# EAGLE design arduino-shield (EAGLE 7.7.0)

## Sheet 1 of 2
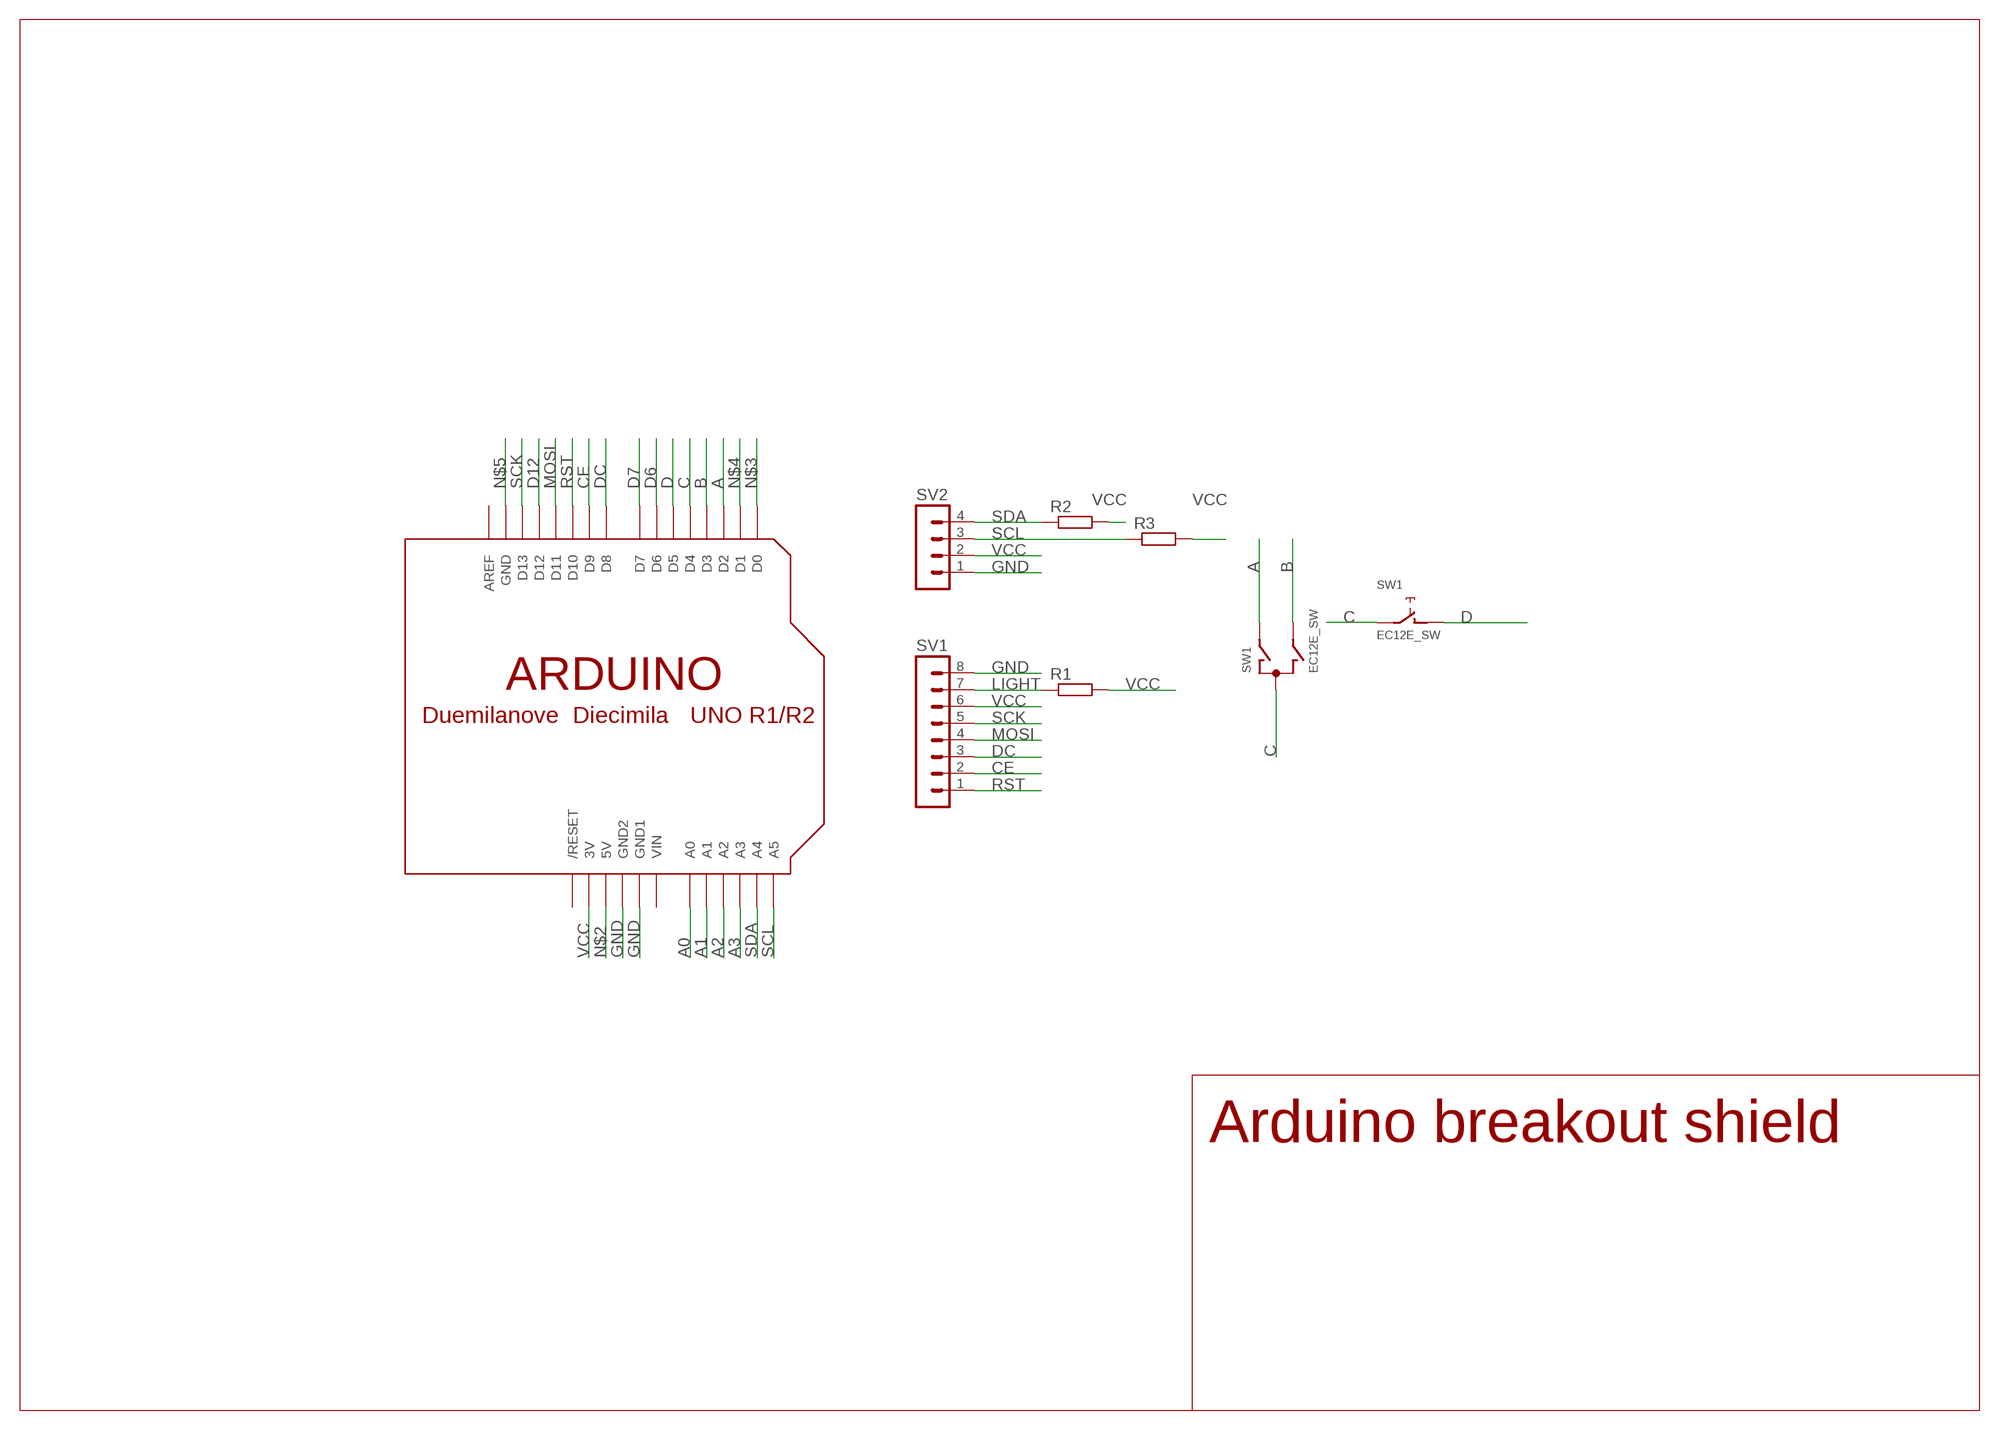
[diagram p0: schematic, sheet 1]

### Parts
R1  R-EU_R0805  [R0805]
R2  R-EU_R0805  [R0805]
R3  R-EU_R0805  [R0805]
SV1  MA08-1  [MA08-1]
SV2  MA04-1  [MA04-1]
SW1  EC12E_SW  [ALPS_EC12E_SW]
U$1  ARDUINO-NOHOLE  [ARDUINO-NOHOLE]

### Nets
A: SW1.A U$1.D2
A0: U$1.A0
A1: U$1.A1
A2: U$1.A2
A3: U$1.A3
B: SW1.B U$1.D3
C: SW1.C SW1.E U$1.D4
CE: SV1.2 U$1.D9
D: SW1.D U$1.D5
D6: U$1.D6
D7: U$1.D7
D12: U$1.D12
DC: SV1.3 U$1.D8
GND: SV1.8 SV2.1 U$1.GND1 U$1.GND2
LIGHT: R1.1 SV1.7
MOSI: SV1.4 U$1.D11
N$2: U$1.5V
N$3: U$1.D0
N$4: U$1.D1
N$5: U$1.GND
RST: SV1.1 U$1.D10
SCK: SV1.5 U$1.D13
SCL: R3.1 SV2.3 U$1.A5
SDA: R2.1 SV2.4 U$1.A4
VCC: R1.2 R2.2 R3.2 SV1.6 SV2.2 U$1.3V
Unconnected: SW1.GND1(G) SW1.GND2(G) U$1.AREF U$1.RESET(/RESET)

### Notes on the sheet
- Arduino breakout shield

## Sheet 2 of 2
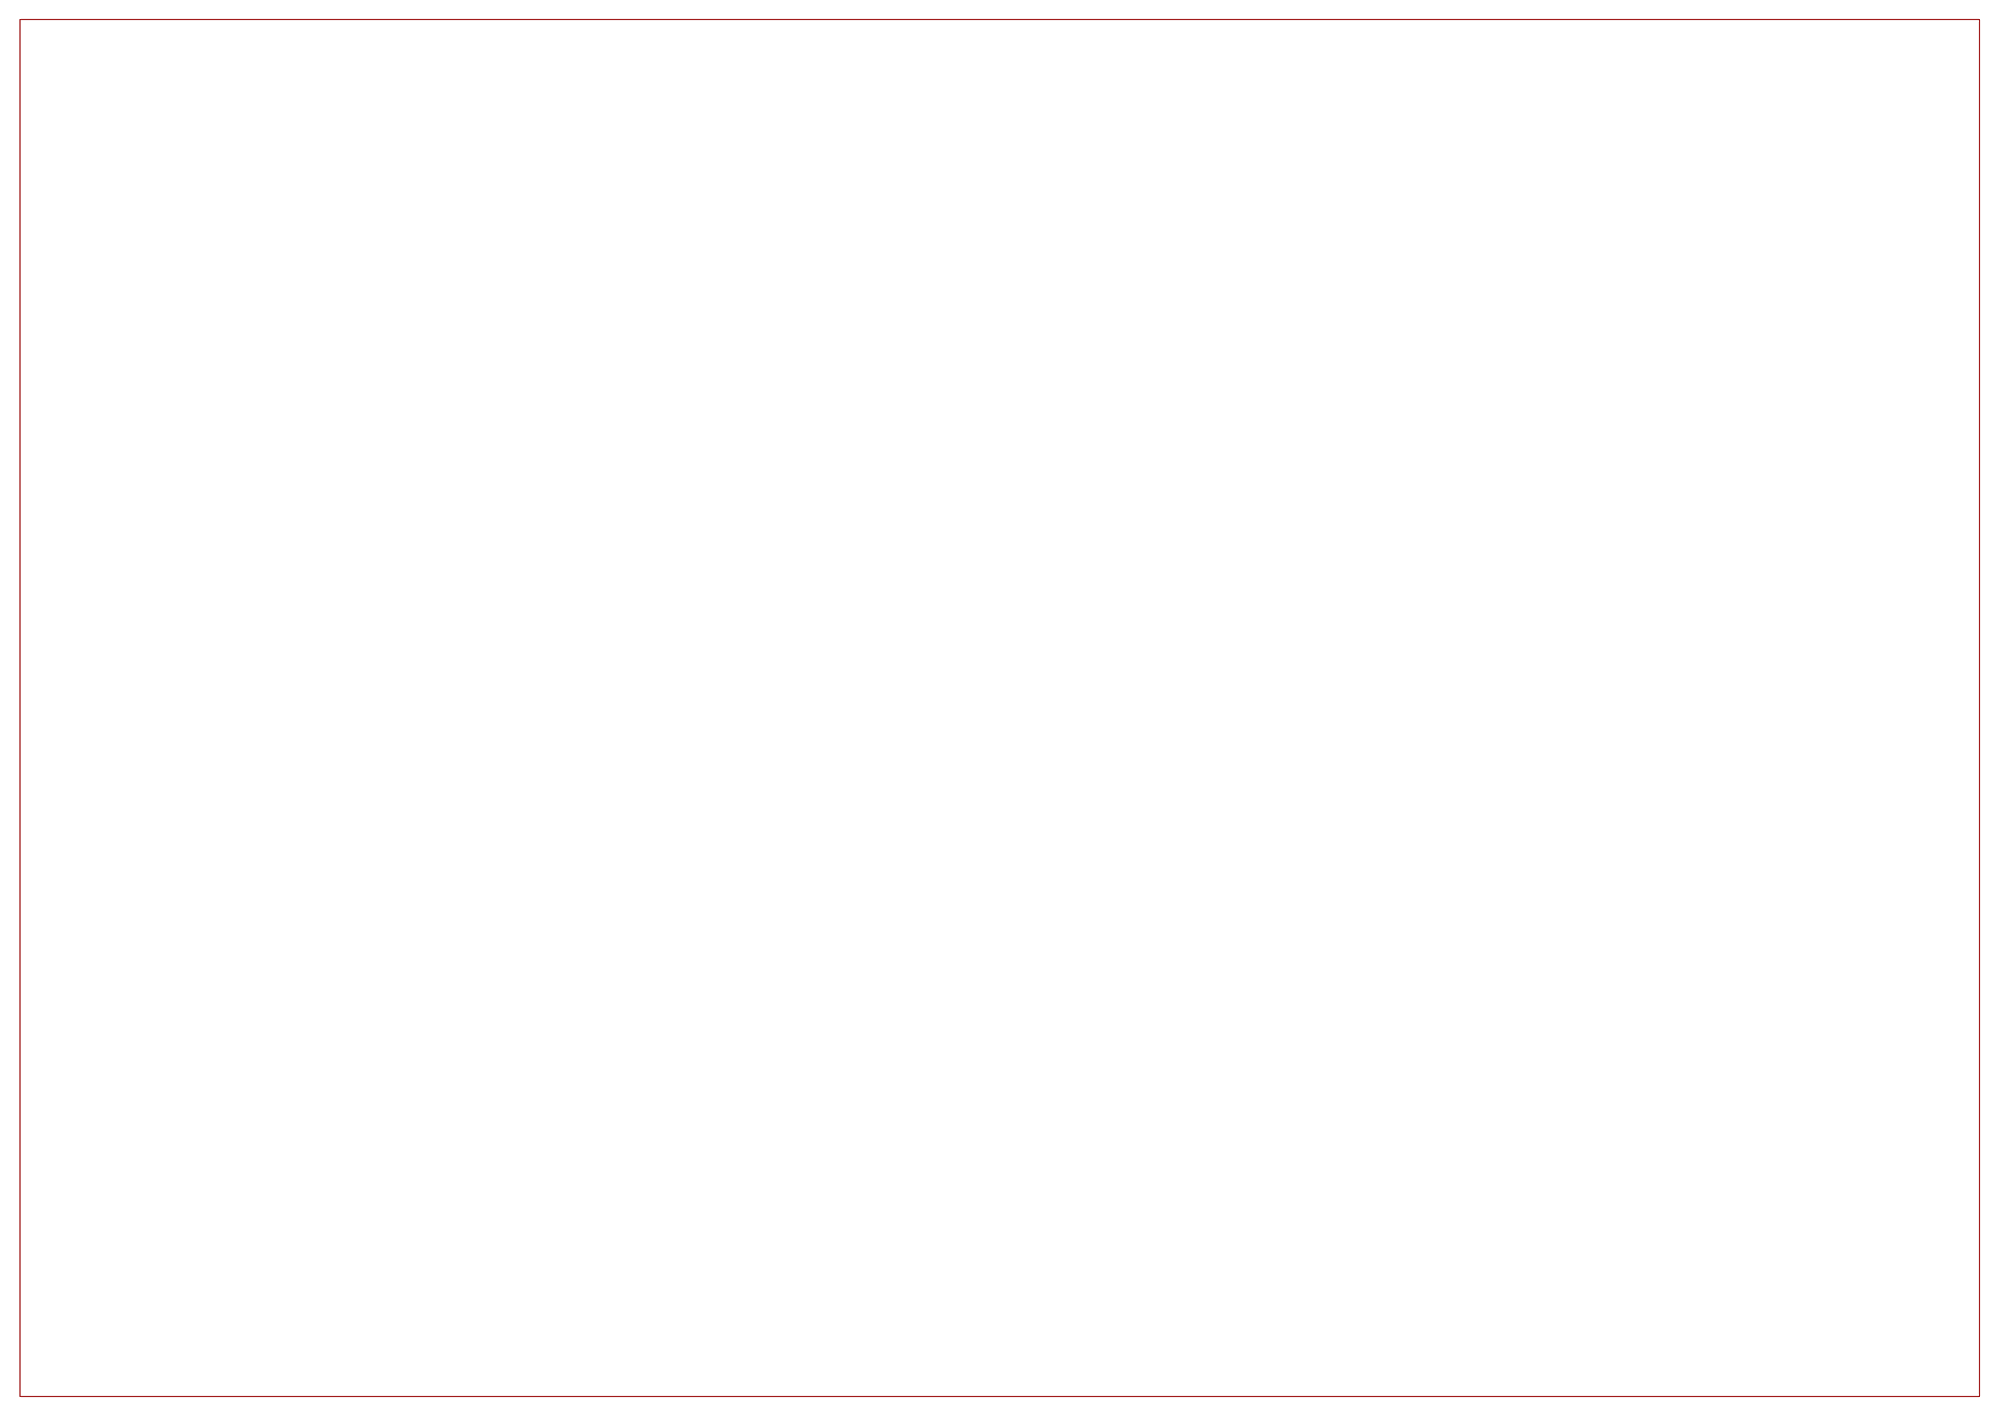
[diagram p1: schematic, sheet 2]

## Power pins joined to a net without a drawn wire
VIN: U$1.VIN

## Library data of the parts
R1-R3 = rcl:R-EU_: RESISTOR, European symbol
SV1 = con-lstb:MA08-1: PIN HEADER; OC_FARNELL: unknown; OC_NEWARK: unknown
SV2 = con-lstb:MA04-1: PIN HEADER; OC_FARNELL: unknown; OC_NEWARK: unknown
SW1 = switch-alps:EC12E_SW: ALPS rotary Encoder EC12E series with switch; MPN: EC12E2424407; OC_FARNELL: 1520813; OC_NEWARK: 74M1068
U$1 = adafruit:ARDUINO: Arduino Diecimila/Duemilanove Make a shield with ease, this package has all the named pins as well as the two mounting drill holes and an outline of the USB and DC power connector. The outline is on the DIMENSION layer, so if your board house uses it they will cut the outline to match. http://www.ladyada.net/library/pcb/eaglelibrary.html

## Board
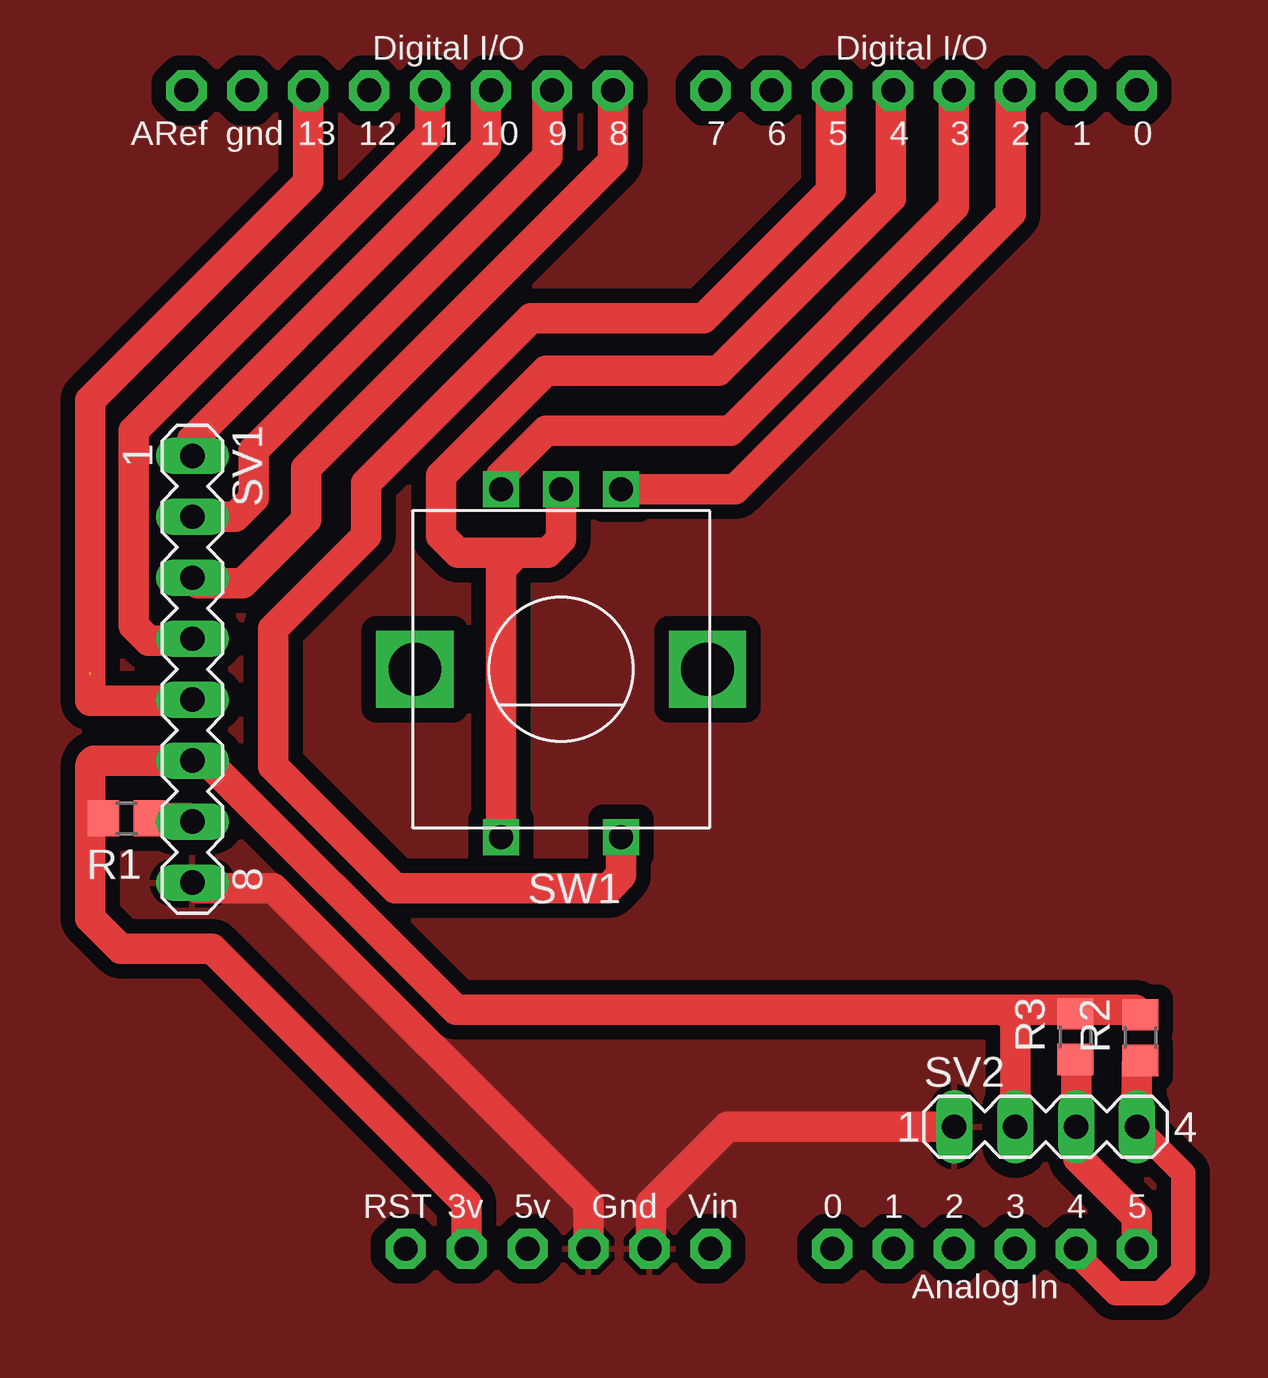
[diagram p2: board, top side]
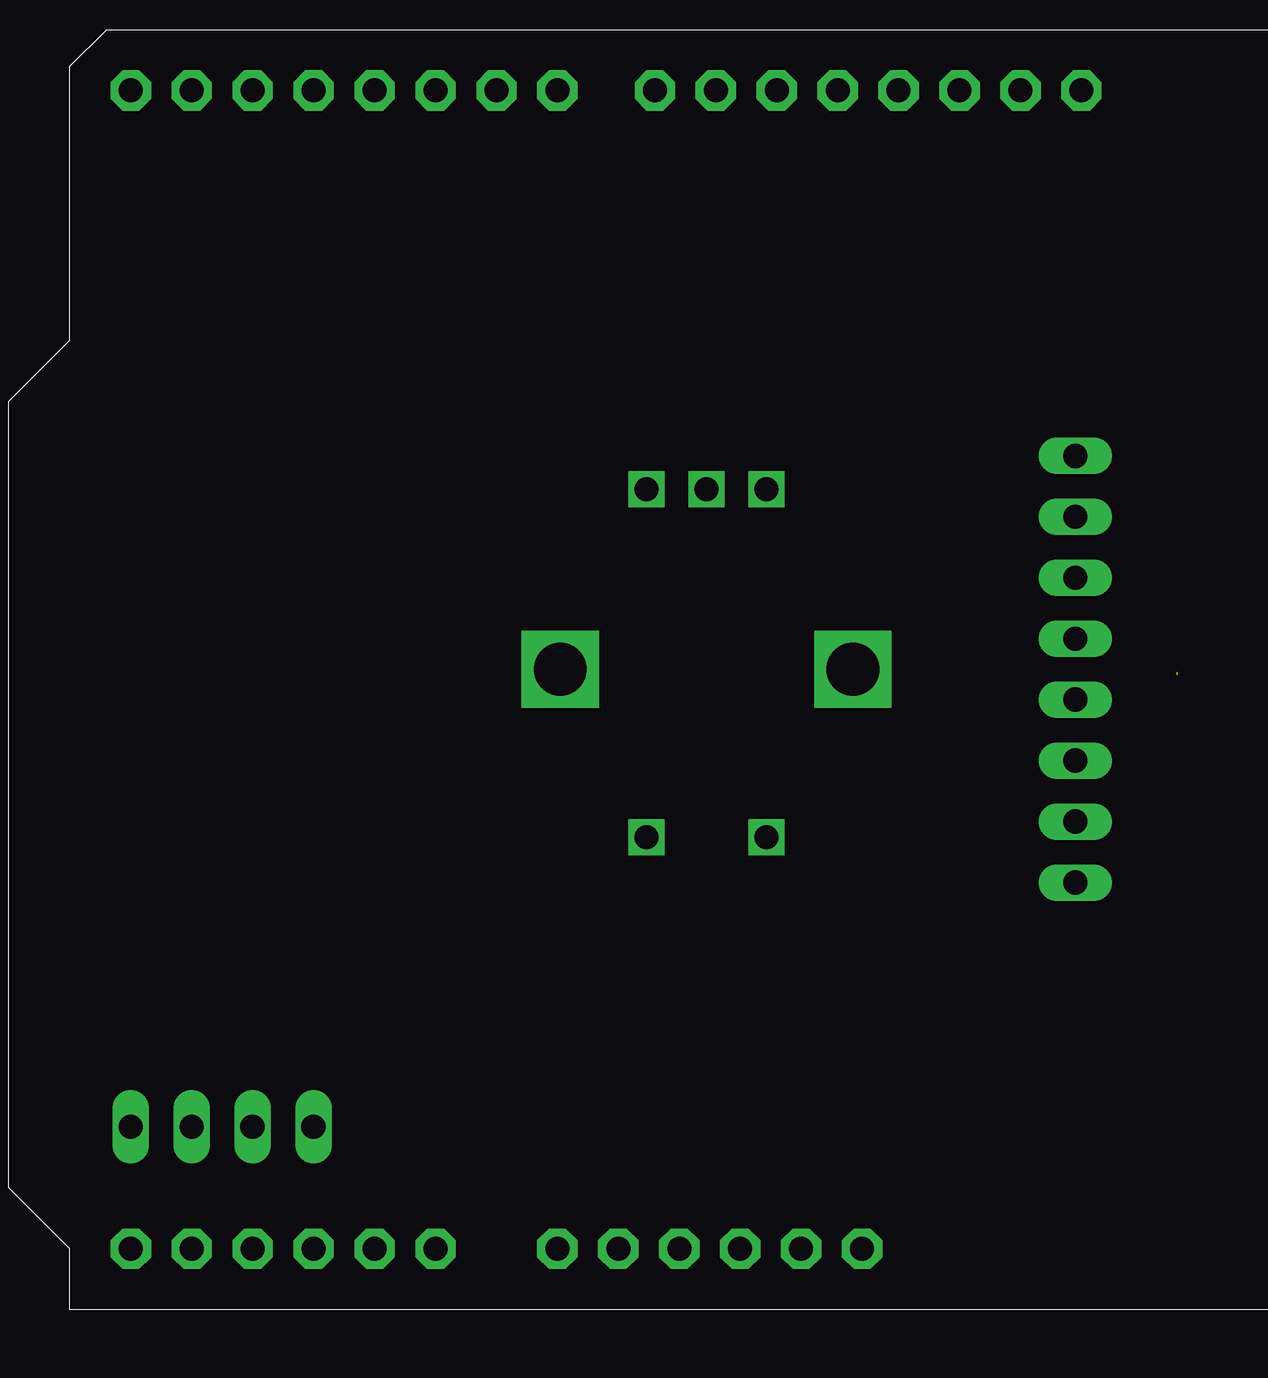
[diagram p3: board, bottom side, seen from below]

No outline drawn. Coordinates in mm, seen from the top.
Copper layers (1*16): Top 0.035mm / dielectric 1.5mm / Bottom 0.035mm
Design rules "default": minimum track width 10mil, minimum drill 24mil, track to track 8mil, track to pad 8mil, pad to pad 8mil, via to via 8mil, smd to smd 8mil, copper to edge 40mil, drill to drill 8mil, minimum pad ring 10mil, minimum via ring 8mil, stop-mask expansion 4mil, vias tented up to drill 0mil, thermal gap 10mil

### Footprints (pad centres in the part's own frame; a part is rotated, then mirrored left to right if it is on the bottom)
R0805 = smd 1.3 x 1.5: 1 -0.95,0; 2 0.95,0
MA08-1 = drill 1.016 long: 1 -8.89,0; 2 -6.35,0; 3 -3.81,0; 4 -1.27,0; 5 1.27,0; 6 3.81,0; 7 6.35,0; 8 8.89,0
MA04-1 = drill 1.016 long: 1 -3.81,0; 2 -1.27,0; 3 1.27,0; 4 3.81,0
ALPS_EC12E_SW = drill 1 square: A -2.5,-7.5; B 2.5,-7.5; C 0,-7.5; D -2.5,7; E 2.5,7 | drill 2.2 square: GND1 -6.1,0; GND2 6.1,0
ARDUINO-NOHOLE = drill 1 pad 1.676 octagon: 3V 35.56,2.54; 5V 38.1,2.54; A0 50.8,2.54; A1 53.34,2.54; A2 55.88,2.54; A3 58.42,2.54; A4 60.96,2.54; A5 63.5,2.54; AREF 23.876,50.8; D0 63.5,50.8; D1 60.96,50.8; D2 58.42,50.8; D3 55.88,50.8; D4 53.34,50.8; D5 50.8,50.8; D6 48.26,50.8; D7 45.72,50.8; D8 41.656,50.8; D9 39.116,50.8; D10 36.576,50.8; D11 34.036,50.8; D12 31.496,50.8; D13 28.956,50.8; GND 26.416,50.8; GND1 43.18,2.54; GND2 40.64,2.54; RESET 33.02,2.54; VIN 45.72,2.54

### Placement (x,y rotation side)
R1  25.62,23.23 180 top
R2  67.9,14.09 90 top
R3  65.19,14.12 90 top
SV1  28.38,29.44 270 top
SV2  63.95,10.37 0 top
SW1  43.75,29.44 180 top
U$1  4.25,2.75 0 top

### Tracks (layer width: path | path; a pad name or v marks a point on that pad's centre or on a via)
A
  Top 1.27: SW1.A 51,36.94 62.5,48.44 62.5,53.38 U$1.D2
B
  Top 1.27: SW1.B 41.25,37.5 43.12,39.37 50.8,39.37 60.13,48.7 U$1.D3
C
  Top 1.27: SW1.C 43.75,34.86 43.18,34.29 41.91,34.29 | 41.91,34.29 39.46,34.29 38.75,35 38.75,37.5 43.12,41.88 50.31,41.88 57.5,49.06 57.5,53.46 U$1.D4 | SW1.E 41.25,33.63 41.91,34.29
CE
  Top 1.27: SV1.2 30.16,35.79 30.94,36.56 30.94,38.56 43.18,50.8 43.18,53.36 U$1.D9
D
  Top 1.27: SW1.D 46.25,20.85 45.72,20.32 36.83,20.32 31.75,25.4 31.75,31.12 35.62,35 35.62,37.19 42.5,44.06 49.69,44.06 55,49.38 55,53.5 U$1.D5
DC
  Top 1.27: U$1.D8 45.91,50.59 33.12,37.81 33.12,35.66 30.48,33.02 28.61,33.02 SV1.3
GND
  Top 1.27: U$1.GND2 44.89,7.18 31.75,20.32 28.61,20.32 SV1.8 | SV2.1 50.69,10.37 47.5,7.19 47.5,5.36 U$1.GND1
  pour Top (isolate 0.61): 0,-3.81 76.2,-3.81 76.2,58.42 0,58.42
LIGHT
  Top 1.27: R1.1 28.24,23.23 SV1.7
MOSI
  Top 1.27: U$1.D11 38.29,51.72 25.94,39.38 25.94,31.25 26.56,30.62 28.3,30.62 SV1.4
RST
  Top 1.27: SV1.1 28.38,39.01 40.62,51.25 40.62,53.35 U$1.D10
SCK  (1 unrouted)
  Top 1.27: U$1.D13 33.21,49.72 24.13,40.64 24.13,29.31 | SV1.5 28.34,28.12 24.13,28.12 24.13,29.21
SCL
  Top 1.27: U$1.A5 67.75,6.62 65.31,9.06 65.31,10.28 SV2.3 65.22,13.14 R3.1
SDA
  Top 1.016: U$1.A4 65.21,5.1 66.88,3.44 68.75,3.44 69.69,4.38 69.69,8.44 SV2.4
  Top 1.27: R2.1 67.75,12.99 SV2.4
VCC
  Top 1.27: U$1.3V 39.81,7.18 29.21,17.78 25.4,17.78 24.13,19.05 24.13,22.86 | 24.13,22.86 24.13,25.4 arc-90 24.36,25.63 SV1.6 28.98,25.63 39.37,15.24 62.23,15.24 | R1.2 24.5,23.23 24.13,22.86 | SV2.2 62.67,14.79 62.23,15.24 | R2.2 67.69,15.24 65.35,15.24 | 65.35,15.24 62.23,15.24 | R3.2 65.35,15.24